# EAGLE schematic Control Board (EAGLE 6.4)

## Sheet 1 of 3: Mechanical
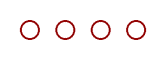
[diagram p0: schematic, sheet 1]

### Parts
STANDOFF1  STAND-OFF  [STAND-OFF]
STANDOFF2  STAND-OFF  [STAND-OFF]
STANDOFF3  STAND-OFF  [STAND-OFF]
STANDOFF4  STAND-OFF  [STAND-OFF]

## Sheet 2 of 3: Interface
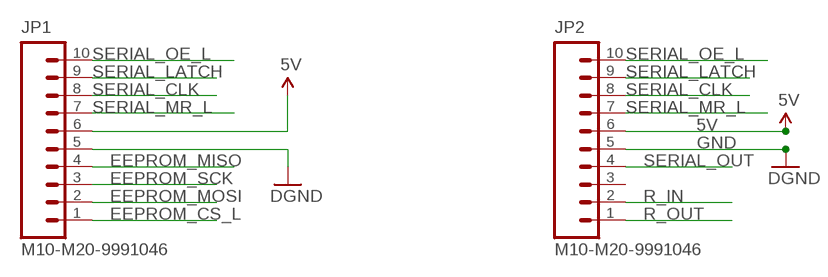
[diagram p1: schematic, sheet 2]

### Parts
JP1  M10-M20-9991046  [M20-9991046]
JP2  M10-M20-9991046  [M20-9991046]

### Nets
5V: JP1.6 JP2.6 ; also sheet 3
EEPROM_CS_L: JP1.1
EEPROM_MISO: JP1.4
EEPROM_MOSI: JP1.2
EEPROM_SCK: JP1.3
GND: JP1.5 JP2.5 ; supply symbol labelled DGND ; also sheet 3
R_IN: JP2.2
R_OUT: JP2.1
SERIAL_CLK: JP1.8 JP2.8
SERIAL_LATCH: JP1.9 JP2.9
SERIAL_MR_L: JP1.7 JP2.7
SERIAL_OE_L: JP1.10 JP2.10
SERIAL_OUT: JP2.4
Unconnected: JP2.3

## Sheet 3 of 3
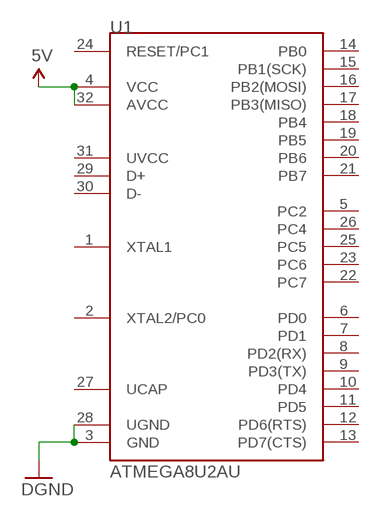
[diagram p2: schematic, sheet 3]

### Parts
U1  ATMEGA8U2AU  [TQFP32-08]

### Nets
5V: U1.4(VCC) U1.32(AVCC) ; also sheet 2
GND: U1.3(GND) U1.28(UGND) ; supply symbol labelled DGND ; also sheet 2
Unconnected: U1.1(XTAL1) U1.2(XTAL2/PC0) U1.5(PC2) U1.6(PD0) U1.7(PD1) U1.8(PD2(RX)) U1.9(PD3(TX)) U1.10(PD4) U1.11(PD5) U1.12(PD6(RTS)) U1.13(PD7(CTS)) U1.14(PB0) U1.15(PB1(SCK)) U1.16(PB2(MOSI)) U1.17(PB3(MISO)) U1.18(PB4) U1.19(PB5) U1.20(PB6) U1.21(PB7) U1.22(PC7) U1.23(PC6) U1.24(RESET/PC1) U1.25(PC5) U1.26(PC4) U1.27(UCAP) U1.29(D+) U1.30(D-) U1.31(UVCC)

## Library data of the parts
JP1 JP2 = Control Board Library:M10: Header 10 Standard 10-pin 0.1" header. Use with straight break away headers (SKU : PRT-00116), right angle break away headers (PRT-00553), swiss pins (PRT-00743), machine pins (PRT-00117), and female headers (PRT-00115).
STANDOFF1-STANDOFF4 = Resistor Module Library:STAND-OFF: #4 Stand Off This is the mechanical footprint for a #4 phillips button head screw. Use the keepout ring to avoid running the screw head into surrounding components. SKU : PRT-00447
U1 = Control Board Library:ATMEGA8U2: Atmel 32-pin 8-bit Microcontroller with 8/16/32K Bystes of ISP Flash and USB Controller. ATmega8U2, ATmega16U2, and ATmega32U2

## Net classes
0 default: width 0.203 mm, drill 0.406 mm, clearance 0.203 mm
1 power: width 0.61 mm, drill 0.406 mm, clearance 0.203 mm
2 gnd: width 0.305 mm, drill 0.406 mm, clearance 0.203 mm
3 power usb: width 0.508 mm, drill 0.406 mm, clearance 0.203 mm